# Altium project pumpctrl.PrjPcb
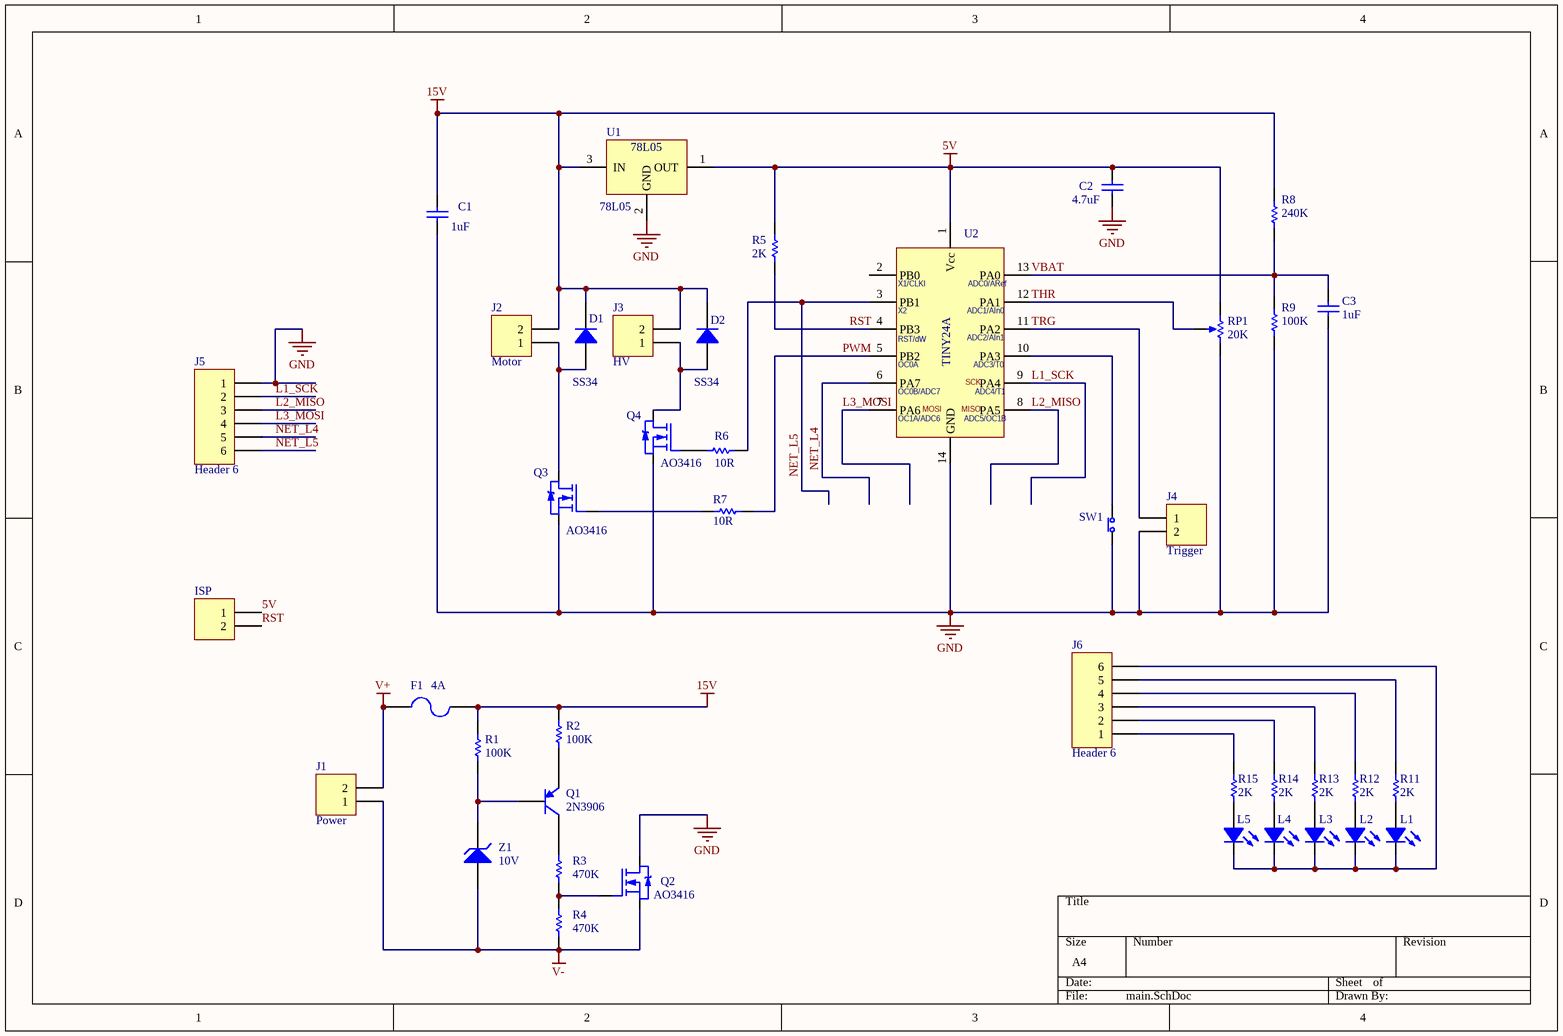
[diagram p0: main.SchDoc]
1 sheet, 41 parts. Net scope: global (net labels, ports and power ports of the same name join across sheets).
Board file: pumpctrl.PcbDoc

## Sheet main.SchDoc
size A4; PageSetup: Record=PageOptions|CenterHorizontal=True|CenterVertical=True|PrintScale=0.97|XCorrection=1.00|YCorrection=1.00|PrintKind=0|BorderSize=5000000|LeftOffset=0|BottomOffset=0|Orientation=2|PaperLength=1000|PaperWidth=1000|Scale=100|PaperSource=7|PrintQuality=-4|MediaType=1|DitherType=10|PaperKind=A4|PrintScaleMode=1

### Parts
C1  value 1uF  [CAP0805]  (hidden comment: Cap)
C2  value 4.7uF  [CAP0805]  (hidden comment: Cap)
C3  value 1uF  [CAP0805]  (hidden comment: Cap)
D1  SS34  [DO214A]
D2  SS34  [DO214A]
F1  4A  [FUSE1206]
ISP  (no value)  [HDR1X2]
J1  Power  [JST2]
J2  Motor  [JST2]
J3  HV  [JST2]
J4  Trigger  [JST2]
J5  Header 6  [HDR125_6W]
J6  Header 6  [HDR125_6W]
L1  高亮翠绿  [LED2G_SLIM]  (value not drawn)
L2  高亮翠绿  [LED2G_SLIM]  (value not drawn)
L3  高亮翠绿  [LED2G_SLIM]  (value not drawn)
L4  高亮翠绿  [LED2G_SLIM]  (value not drawn)
L5  高亮蓝色  [LED2R_SLIM]  (value not drawn)
Q1  2N3906  [SOT23_CBE]
Q2  AO3416  [SOT23_NMOS]
Q3  AO3416  [SOT23_NMOS]
Q4  AO3416  [SOT23_NMOS]
R1  value 100K  [RES0805]  (hidden comment: Res1)
R2  value 100K  [RES0805]  (hidden comment: Res1)
R3  value 470K  [RES0805]  (hidden comment: Res1)
R4  value 470K  [RES0805]  (hidden comment: Res1)
R5  value 2K  [RES0805]  (hidden comment: Res1)
R6  value 10R  [RES0805]  (hidden comment: Res1)
R7  value 10R  [RES0805]  (hidden comment: Res1)
R8  value 240K  [RES0805]  (hidden comment: Res1)
R9  value 100K  [RES0805]  (hidden comment: Res1)
R11  value 2K  [RES0805]  (hidden comment: Res1)
R12  value 2K  [RES0805]  (hidden comment: Res1)
R13  value 2K  [RES0805]  (hidden comment: Res1)
R14  value 2K  [RES0805]  (hidden comment: Res1)
R15  value 2K  [RES0805]  (hidden comment: Res1)
RP1  value 20K  [POT_RV09]  (hidden comment: RPot)
SW1  (no value)  [TACT2]
U1  78L05  [SOT89_VREG]
U2  TINY24A  [SO14]  (value not drawn)
Z1  10V  [1N4148SMT]

### Nets
5V: C2.2 ISP.1 R5.2 RP1.1(TOP) U1.1(OUT) U2.1(Vcc)
15V: C1.2 D1.2(K) D2.2(K) F1.1 J2.2 J3.2 R1.1 R2.1 R8.2 U1.3(IN)
GND: C1.1 C2.1 C3.1 J4.2 J5.1 Q2.D Q3.S Q4.S R9.1 RP1.2(BOT) SW1.1 U1.2(GND) U2.14(GND)
V+: F1.2 J1.2
V-: J1.1 Q2.S R4.2 Z1.1(A)
L1_SCK: J5.2 U2.9(PA4)
L2_MISO: J5.3 U2.8(PA5)
L3_MOSI: J5.4 U2.7(PA6)
NET_L4: J5.5 U2.6(PA7)
NET_L5: J5.6 R6.1 U2.3(PB1)
PWM: R7.2 U2.5(PB2)
RST: ISP.2 R5.1 U2.4(PB3)
THR: RP1.3(TAP) U2.12(PA1)
TRG: J4.1 U2.11(PA2)
VBAT: C3.2 R8.1 R9.2 U2.13(PA0)
NetD1_1: D1.1(A) J2.1 Q3.D
NetD2_1: D2.1(A) J3.1 Q4.D
NetJ6_1: J6.1 R15.1
NetJ6_2: J6.2 R14.1
NetJ6_3: J6.3 R13.1
NetJ6_4: J6.4 R12.1
NetJ6_5: J6.5 R11.1
NetJ6_6: J6.6 L1.2(K) L2.2(K) L3.2(K) L4.2(K) L5.2(K)
NetL1_1: L1.1(A) R11.2
NetL2_1: L2.1(A) R12.2
NetL3_1: L3.1(A) R13.2
NetL4_1: L4.1(A) R14.2
NetL5_1: L5.1(A) R15.2
NetQ1_B: Q1.B R1.2 Z1.2(K)
NetQ1_C: Q1.C R3.1
NetQ1_E: Q1.E R2.2
NetQ2_G: Q2.G R3.2 R4.1
NetQ3_G: Q3.G R7.1
NetQ4_G: Q4.G R6.2
NetSW1_2: SW1.2 U2.10(PA3)

Not connected (* = marked no-connect by the designer): U2 2(PB0)

### Notes on the sheet
- (in symbol TINY13A) X1/CLKI; ADC0/ARef; X2; ADC1/AIn0; RST/dW; ADC2/AIn1; OC0A; ADC3/T0; SCK; OC0B/ADC7; ADC4/T1; MOSI; MISO; OC1A/ADC6; ADC5/OC1B

### Library data of the parts
C1-C3 = Cap: 贴片电容; Published: 8-Jun-2000; LatestRevisionDate: 17-Jul-2002; LatestRevisionNote: Re-released for DXP Platform.; PackageReference: RAD-0.3; Publisher: Altium Limited; PackageDescription: Radial Cap, Thru-Hole; 2 Leads; 0.3 in Pin Spacing
D1 D2 = Diode: 贴片二极管; Published: 8-Jun-2000; LatestRevisionDate: 17-Jul-2002; LatestRevisionNote: Re-released for DXP Platform.; DatasheetDocument: 1999; PackageDocument: Aug-1999; PackageReference: DO-41; Publisher: Altium Limited; ComponentLink1Description: Manufacturer Link; ComponentLink1URL: http://www.fairchildsemi.com/; Code_JEDEC: DO-204-AL
F1 = Fuse 2: 贴片熔断型保险丝; Published: 8-Jun-2000; LatestRevisionDate: 17-Jul-2002; LatestRevisionNote: Re-released for DXP Platform.; Publisher: Altium Limited
ISP = Header 2: 空; LatestRevisionDate: 17-Jul-2002; LatestRevisionNote: Re-released for DXP Platform.; Publisher: Altium Limited
J1-J4 = Header 2: JST 2P 插座; LatestRevisionDate: 17-Jul-2002; LatestRevisionNote: Re-released for DXP Platform.; Publisher: Altium Limited
J5 J6 = Header 6: 1.25mm 6P 插座; LatestRevisionDate: 17-Jul-2002; LatestRevisionNote: Re-released for DXP Platform.; Publisher: Altium Limited
L1-L5 = LED: 贴片LED 0805; Published: 8-Jun-2000; LatestRevisionDate: 08-Jul-2005; LatestRevisionNote: Mech Layer 1 removed.; PackageReference: LED-0; Publisher: Altium Limited; PackageDescription: LED; 2 Leads
Q1 = PNP: PNP General Purpose Amplifier; Published: 8-Jun-2000; LatestRevisionDate: 15-Jan-2003; LatestRevisionNote: PCB Footprint 'BCY-W3/D4.7' replaced; DatasheetVersion: 1997; PackageVersion: Sep-1998; PackageReference: TO-92A; Publisher: Altium Limited; PackageDescription: TO, Flat Index; 3 In-Line, Axial Leads; Body Dia. 4.5mm; Leads 0.51 x 0.48 mm (max); ComponentLink1Description: Manufacturer Link; ComponentLink1URL: http://www.fairchildsemi.com/; ComponentLink2Description: Datasheet; ComponentLink2URL: http://www.fairchildsemi.com/ds/2N%2F2N3906.pdf
Q2-Q4 = NMOS: MOSFET N; Published: 8-Jun-2000; LatestRevisionDate: 17-Jul-2002; LatestRevisionNote: Re-released for DXP Platform.; PackageVersion: 1995/1996; PackageReference: E3; Publisher: Altium Limited; PackageDescription: TO, Flat Index; 3 In-Line, Axial Leads; Body Dia. 4.6mm; Lead Dia. 0.5 mm (max)
R1-R9 R11-R15 = Res1: 贴片电阻; Accuracy: 1%; Published: 8-Jun-2000; LatestRevisionDate: 17-Jul-2002; LatestRevisionNote: Re-released for DXP Platform.; PackageReference: AXIAL-0.3; Publisher: Altium Limited; PackageDescription: Axial Device, Thru-Hole; 2 Leads; 0.3 in Pin Spacing
RP1 = RPot: Potentiometer; Sim Note: Enter the Resistance value and the set point into parameter fields.; Set Position: 0.5; Published: 8-Jun-2000; LatestRevisionDate: 17-Jul-2002; LatestRevisionNote: Re-released for DXP Platform.; PackageReference: VR5; Publisher: Altium Limited; PackageDescription: Variable Resistor, Thru-Hole; 3 Leads
SW1 = JP2: 轻触开关; Accuracy: 1%; Published: 8-Jun-2000; LatestRevisionDate: 17-Jul-2002; LatestRevisionNote: Re-released for DXP Platform.; PackageReference: AXIAL-0.3; Publisher: Altium Limited; PackageDescription: Axial Device, Thru-Hole; 2 Leads; 0.3 in Pin Spacing
U1 = 78L05: 三端稳压贴片; Published: 24-Aug-2001; LatestRevisionDate: 6-Jun-2005; LatestRevisionNote: PCB pads lengthened.; DatasheetDocument: Apr-1994; PackageDocument: Jun-2004; PackageReference: TO-252; Publisher: Altium Limited; ComponentLink1Description: Manufacturer Link; ComponentLink1URL: http://www.st.com/
U2 = TINY13A: 集成电路
Z1 = D Zener: Zener Diode; Published: 8-Jun-2000; LatestRevisionDate: 17-Jul-2002; LatestRevisionNote: Re-released for DXP Platform.; PackageReference: DIODE-0.7; Publisher: Altium Limited; PackageDescription: Diode, Thru-Hole; 2 Leads; 0.7 in Pin Spacing